# Altium schematic sheet KURSUCH.SchDoc
size A4; SheetNumber: 1; SheetTotal: 1
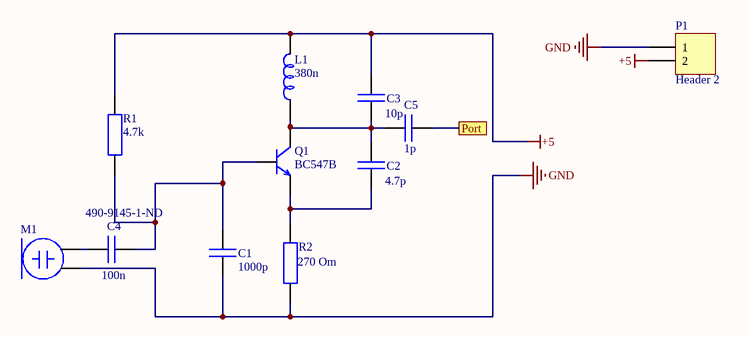
[diagram p0: KURSUCH.SchDoc]

## Parts
C1  1000p  [Capacitor-2,5]
C2  4.7p  [Capacitor-2,5]
C3  10p  [Capacitor-2,5]
C4  100n  Supplier Part Number 1: 490-9145-1-ND  [Capacitor-2,5]
C5  1p  [Capacitor-2,5]
L1  380n  [Inductor1]
M1  Mic  [Mic]  (value not drawn)
P1  Header 2  [HDR1X2]
Q1  BC547B  [Transistor]
R1  4.7k  [Resistor]
R2  270 Om  [Resistor]

## Ports
Port

## Nets
+5: C3.2 L1.2 P1.2 R1.2
GND: C1.1 M1.2 P1.1 R2.1
Port: C5.2 ; port Port
NetC1_2: C1.2 C4.2 Q1.2 R1.1
NetC2_1: C2.1 Q1.3 R2.2
NetC2_2: C2.2 C3.1 C5.1 L1.1 Q1.1
NetC4_1: C4.1 M1.1

## Library data of the parts
C1 = Capaciitor: Cap Ceramic 1uF 16V X7R 10% Radial 5mm 125°C Bulk; Manufacturer: TDK; Manufacturer Part Number: FK24X7R1C105KN000; Supplier 1: DigiKey; Supplier Part Number 1: 445-FK24X7R1C105KN000-ND; RoHS: Yes; Category: Ceramic Capacitors; Stock 1: 767; Pricing 1: 1=0,44000, 10=0,30600, 50=0,21400, 100=0,18350, 500=0,13760, 1000=0,11620, 2500=0,11009, 5000=0,10397 (USD); Case/Package: Radial; RoHS Compliant: Yes; ComponentLink1URL: http://product.tdk.com/en/catalog/datasheets/leadmlcc_commercial_general_en.pdf?src-supplier=Avnet; ComponentLink1Description: http://product.tdk.com/en/catalog/datasheets/leadmlcc_commercial_general_en.pdf?src-supplier=Avnet; Supplier 2: Digi-Key; Supplier Part Number 2: 445-FK24X7R1C105KN000-ND; Stock 2: 753; Pricing 2: 1=0,44000, 10=0,30600, 50=0,21400, 100=0,18350, 500=0,13760, 1000=0,11620, 2500=0,11009, 5000=0,10397 (USD)
C2 = Capaciitor: Capacitor Ceramic 4.7pF 50V C0G 0.25pF 2.5mm T/R; Manufacturer: TDK; Manufacturer Part Number: FA18C0G1H4R7CNU06; Lead/Base Style: Formed Leads; Supplier 1: Digi-Key; Supplier Part Number 1: 445-180473-1-ND; RoHS: Yes; Category: Ceramic Capacitors; Stock 1: 3272; Pricing 1: 1=0,29000, 10=0,20100, 50=0,13420, 100=0,11410, 500=0,08052, 1000=0,07046 (USD); Mount: Through Hole; Case/Package: Radial; Min Operating Temperature: -55°C; Max Operating Temperature: 125°C; Packaging: Tape and Reel; Capacitance: 4.7pF; Voltage Rating: 50V; Length: 0.157inch; Width: 0.098inch; Height - Seated (Max): 0.217inch; Lead Pitch: 0.098inch; Ratings: AEC-Q200; RoHS Compliant: Yes; ComponentLink1URL: https://product.tdk.com/info/en/catalog/datasheets/leadmlcc_halogenfree_fa_en.pdf?src-supplier=Digi-Key; ComponentLink1Description: https://product.tdk.com/info/en/catalog/datasheets/leadmlcc_halogenfree_fa_en.pdf?src-supplier=Digi-Key
C3 = Capaciitor: CAP CER 10PF 50V C0G RADIAL; Manufacturer: TDK; Manufacturer Part Number: FG18C0G1H100DNT06; Lead/Base Style: Formed Leads; Supplier 1: Digi-Key; Supplier Part Number 1: 445-173169-1-ND; RoHS: Yes; Category: Ceramic Capacitors; Stock 1: 2402; Pricing 1: 1=0,28000, 10=0,19400, 50=0,11640, 100=0,09820, 500=0,06720, 1000=0,05946 (USD); Mount: Through Hole; Case/Package: Radial; Min Operating Temperature: -55°C; Max Operating Temperature: 125°C; Packaging: Cut Tape; Capacitance: 10pF; Voltage Rating: 50V; Length: 0.157inch; Width: 0.098inch; Height - Seated (Max): 0.217inch; Lead Pitch: 0.098inch; RoHS Compliant: Yes; ComponentLink1URL: https://product.tdk.com/info/en/documents/chara_sheet/FG18C0G1H100DNT06.pdf?src-supplier=Digi-Key; ComponentLink1Description: https://product.tdk.com/info/en/documents/chara_sheet/FG18C0G1H100DNT06.pdf?src-supplier=Digi-Key; ComponentLink2URL: https://product.tdk.com/info/en/catalog/datasheets/leadmlcc_halogenfree_fg_en.pdf?src-supplier=Digi-Key; ComponentLink2Description: https://product.tdk.com/info/en/catalog/datasheets/leadmlcc_halogenfree_fg_en.pdf?src-supplier=Digi-Key
C4 = Capaciitor: CAP CER 0.1UF 50V X7R RADIAL; Manufacturer: Murata; Manufacturer Part Number: RDER71H104K0S1H03A; Capacitance: 100nF; Tolerance: 10%; Lead/Base Style: Formed Leads; Lead Diameter: 0.5mm; Supplier 1: Digi-Key; RoHS: Yes; Category: Ceramic Capacitors; Stock 1: 41608; Pricing 1: 1=0,34000, 10=0,23800, 50=0,16640, 100=0,14260, 500=0,10692, 1000=0,09029 (USD); Mount: Through Hole; Case/Package: Radial; Min Operating Temperature: -55°C; Max Operating Temperature: 125°C; Package Quantity: 2000; Packaging: Tape and Reel; Voltage Rating: 50V; Dielectric: X7R; Termination: Radial; Resistor Type: Ceramic; Voltage Rating (DC): 50V; Length: 0.197inch; Width: 0.098inch; Height: 3.5mm; Height - Seated (Max): 0.236inch; Lead Pitch: 0.098inch; Lead Free: Lead Free; RoHS Compliant: Yes; ComponentLink1URL: http://www.mouser.com/ds/2/281/c49e-506.pdf?src-supplier=Mouser; ComponentLink1Description: http://www.mouser.com/ds/2/281/c49e-506.pdf?src-supplier=Mouser; ComponentLink2URL: https://search.murata.co.jp/Ceramy/image/img/A01X/partnumbering_e_03.pdf?src-supplier=Digi-Key; ComponentLink2Description: https://search.murata.co.jp/Ceramy/image/img/A01X/partnumbering_e_03.pdf?src-supplier=Digi-Key; ComponentLink3URL: http://psearch.en.murata.com/capacitor/product/RDER71H104K0S1H03A.pdf?src-supplier=Avnet; ComponentLink3Description: http://psearch.en.murata.com/capacitor/product/RDER71H104K0S1H03A.pdf?src-supplier=Avnet
C5 = Capaciitor: Capacitor Ceramic 01pF 100V C0G 0.25pF 2.5mm Bulk; Manufacturer: TDK; Manufacturer Part Number: FA18C0G2A010CNU00; Supplier 1: Digi-Key; Supplier Part Number 1: 445-FA18C0G2A010CNU00-ND; RoHS: Yes; Category: Ceramic Capacitors; Stock 1: 500; Pricing 1: 1=0,38000, 10=0,26100, 50=0,17420, 100=0,14810, 500=0,10454, 1000=0,09148, 2500=0,08712, 5000=0,08059 (USD); RoHS Compliant: Yes
L1 = Inductor: FIXED IND 380NH 2.5A 25.5 MOHM; Manufacturer: Abracon; Manufacturer Part Number: AIAC-4125C-R380J-T; Core Material: Air; Tolerance: 5%; Shielding: Unshielded; DC Resistance (DCR): 25.5mR; Q Factor: 100; Self Resonant Frequency: 500MHz; Test Frequency: 50MHz; Supplier 1: Digi-Key; Supplier Part Number 1: 535-12013-1-ND; RoHS: Yes; Category: Fixed Inductors; Stock 1: 1374; Pricing 1: 1=1,01000, 10=0,93600, 25=0,86400, 50=0,72000, 100=0,67680, 250=0,60480, 500=0,51840 (USD); Mount: Surface Mount; Case/Package: Nonstandard; Min Operating Temperature: -40°C; Max Operating Temperature: 125°C; Package Quantity: 1000; Packaging: Tape and Reel; Current Rating: 2.5A; Inductance: 380nH; Max DC Current: 2.5A; Termination: SMD/SMT; Resistor Type: Wirewound; Series: AIAC-4125C; Length: 0.354inch; Width: 4.4mm; Lead Pitch: 9mm; Height - Seated (Max): 0.197inch; RoHS Compliant: Yes; ComponentLink1URL: https://datasheet.ciiva.com/13311/aiac-4125c-218511-13311568.pdf?src-supplier=Mouser; ComponentLink1Description: https://datasheet.ciiva.com/13311/aiac-4125c-218511-13311568.pdf?src-supplier=Mouser; ComponentLink2URL: https://datasheet.ciiva.com/6708/aiac-4125c-6708566.pdf?src-supplier=Digi-Key; ComponentLink2Description: https://datasheet.ciiva.com/6708/aiac-4125c-6708566.pdf?src-supplier=Digi-Key; ComponentLink3URL: https://datasheet.ciiva.com/6708/aiac-4125c-6708567.pdf?src-supplier=Digi-Key; ComponentLink3Description: https://datasheet.ciiva.com/6708/aiac-4125c-6708567.pdf?src-supplier=Digi-Key; ComponentLink4URL: https://datasheet.ciiva.com/6690/aiac-4125c-6690967.pdf?src-supplier=Digi-Key; ComponentLink4Description: https://datasheet.ciiva.com/6690/aiac-4125c-6690967.pdf?src-supplier=Digi-Key
P1 = Header 2: Header, 2-Pin; LatestRevisionDate: 17-Jul-2002; LatestRevisionNote: Re-released for DXP Platform.; Publisher: Altium Limited
Q1 = Transistor: ON SEMICONDUCTOR - BC547B - Bipolar (BJT) Single Transistor, General Purpose, NPN, 45 V, 300 MHz, 500 mW, 100 mA, 110 hFE; Manufacturer: ON Semiconductor / Fairchild; Collector Emitter Voltage (VCEO): 45V; Power Dissipation: 500mW; Collector Base Voltage (VCBO): 50V; Emitter Base Voltage (VEBO): 6V; Max Collector Current: 100mA; Number of Elements: 1; hFE Min: 200; Frequency: 300MHz; Gain Bandwidth Product: 100MHz; Collector Emitter Saturation Voltage: 300mV; Voltage: 40V; Supplier 1: Newark; Supplier Part Number 1: 25AC6284; Manufacturer Part Number: BC547B; RoHS: Yes; Category: BJTs; Stock 1: 7258; Pricing 1: 10000=0,05500 (USD); Mount: Through Hole; Case/Package: TO-92; Number of Pins: 3; Contact Plating: Copper,Tin,Silver; Weight: 0.007055oz; Min Operating Temperature: -65°C; Max Operating Temperature: 150°C; Polarity: NPN; Max Power Dissipation: 500mW; Packaging: Bulk; Element Configuration: Single; Voltage Rating (DC): 45V; Current Rating: 100mA; Package Quantity: 2000; Collector Emitter Breakdown Voltage: 45V; Transition Frequency: 300MHz; Max Frequency: 300MHz; Max Breakdown Voltage: 45V; Length: 4.58mm; Width: 3.86mm; Height: 4.58mm; Radiation Hardening: No; REACH SVHC: No SVHC; Lead Free: Lead Free; ComponentLink1URL: https://datasheet.ciiva.com/17011/bc547-17011404.pdf?src-supplier=Future+Electronics; ComponentLink1Description: https://datasheet.ciiva.com/17011/bc547-17011404.pdf?src-supplier=Future+Electronics; ComponentLink2URL: https://datasheet.ciiva.com/985/bc546-547-548rev5-985523.pdf?src-supplier=Digi-Key; ComponentLink2Description: https://datasheet.ciiva.com/985/bc546-547-548rev5-985523.pdf?src-supplier=Digi-Key; ComponentLink3URL: https://datasheet.ciiva.com/972/bc546-972262.pdf?src-supplier=Digi-Key; ComponentLink3Description: https://datasheet.ciiva.com/972/bc546-972262.pdf?src-supplier=Digi-Key; ComponentLink4URL: https://datasheet.ciiva.com/1195/1868820-1195464.pdf?src-supplier=Element14; ComponentLink4Description: https://datasheet.ciiva.com/1195/1868820-1195464.pdf?src-supplier=Element14; ComponentLink5URL: https://datasheet.ciiva.com/25996/bc550-25996616.pdf?src-supplier=Avnet+Europe; ComponentLink5Description: https://datasheet.ciiva.com/25996/bc550-25996616.pdf?src-supplier=Avnet+Europe; ComponentLink6URL: https://datasheet.ciiva.com/11197/bc550-11197769.pdf?src-supplier=Avnet; ComponentLink6Description: https://datasheet.ciiva.com/11197/bc550-11197769.pdf?src-supplier=Avnet; ComponentLink7URL: https://datasheet.ciiva.com/16472/bc550-16472201.pdf?src-supplier=Avnet+Asia; ComponentLink7Description: https://datasheet.ciiva.com/16472/bc550-16472201.pdf?src-supplier=Avnet+Asia
R1 = Resistor: Res Metal Film 4.7K Ohm 2% 0.25W(1/4W) ±100ppm/C 0.01% Epoxy AXL Bulk; Manufacturer: Vishay Dale; Manufacturer Part Number: RLR07C4701GRB14; Resistance: 4.7kR; Max Power Dissipation: 250mW; Temperature Coefficient: 100ppm/°C; Supplier 1: Digi-Key; Supplier Part Number 1: RLR07C4701GRB14-ND; RoHS: No; Category: Through-Hole Resistors; Stock 1: 35; Pricing 1: 1=2,75000, 10=2,43900, 25=2,26200, 50=2,12880, 100=1,86270, 250=1,59660, 500=1,33050, 1000=1,17971 (USD); Mount: Through Hole; Case/Package: Conformal; Contact Plating: Tin,Lead; Min Operating Temperature: -65°C; Max Operating Temperature: 150°C; Packaging: Bulk; Tolerance: 2%; Package Quantity: 100; Resistor Type: Metal Film; Number of Terminations: 2; Failure Rate: 0.01%; Termination: Axial; Features: Moisture Resistant,Military,Weldable; Series: Military, MIL-PRF-39017/01, RLR07; Construction: Cylindrical; Diameter: 2.29mm; Length: 7.62mm; Width: 2.29mm; Military Standard: MIL-PRF-39017; Lead Free: Contains Lead; RoHS Compliant: No; ComponentLink1URL: https://datasheet.ciiva.com/8820/erl-8820231.pdf?src-supplier=Avnet; ComponentLink1Description: https://datasheet.ciiva.com/8820/erl-8820231.pdf?src-supplier=Avnet; ComponentLink2URL: https://datasheet.ciiva.com/2772/erl-2772812.pdf?src-supplier=Digi-Key; ComponentLink2Description: https://datasheet.ciiva.com/2772/erl-2772812.pdf?src-supplier=Digi-Key
R2 = Resistor: Res Carbon Film 270 Ohm 5% 0.125W(1/8W) -400ppm/C to 0ppm/C Conformal Coated AXL T/R; Manufacturer: Stackpole Electronics; Manufacturer Part Number: CF18JT270R; Resistance: 270R; Temperature Coefficient: -400ppm/°C; Max Power Dissipation: 125mW; Supplier 1: Digi-Key; Supplier Part Number 1: CF18JT270RCT-ND; RoHS: Yes; Category: Through-Hole Resistors; Stock 1: 379; Pricing 1: 1=0,10000, 10=0,04500, 25=0,03240, 50=0,02480, 100=0,01830, 250=0,01396, 500=0,01116, 1000=0,00822 (USD); Mount: Through Hole,Axial; Case/Package: Conformal; Contact Plating: Tin,Matte; Min Operating Temperature: -55°C; Max Operating Temperature: 155°C; Tolerance: 5%; Packaging: Tape and Reel; Package Quantity: 1; Resistor Type: Carbon Film; Number of Terminations: 2; Termination: Axial; Features: Flame Retardant Coating; Series: CF; Construction: Cylindrical; Diameter: 1.7mm; Length: 3.3mm; Radiation Hardening: No; Military Standard: Not; RoHS Compliant: Yes; ComponentLink1URL: http://components.arrow.com/part/dataview/31494781S5811587N1174?src-supplier=Arrow+Electronics; ComponentLink1Description: http://components.arrow.com/part/dataview/31494781S5811587N1174?src-supplier=Arrow+Electronics; ComponentLink2URL: https://www.seielect.com/Catalog/SEI-CF_CFM.pdf?src-supplier=Digi-Key; ComponentLink2Description: https://www.seielect.com/Catalog/SEI-CF_CFM.pdf?src-supplier=Digi-Key; ComponentLink3URL: https://www.seielect.com/catalog/SEI-Packaging.pdf?src-supplier=Digi-Key; ComponentLink3Description: https://www.seielect.com/catalog/SEI-Packaging.pdf?src-supplier=Digi-Key; ComponentLink4URL: https://www.verical.com/server-webapp/html/getDatasheet?partID=558178&src-supplier=Verical; ComponentLink4Description: https://www.verical.com/server-webapp/html/getDatasheet?partID=558178&src-supplier=Verical; ComponentLink5URL: https://www.seielect.com/catalog/SEI-CF_CFM.pdf?src-supplier=Avnet; ComponentLink5Description: https://www.seielect.com/catalog/SEI-CF_CFM.pdf?src-supplier=Avnet